# Altium schematic sheet ShEj4.SchDoc
size A
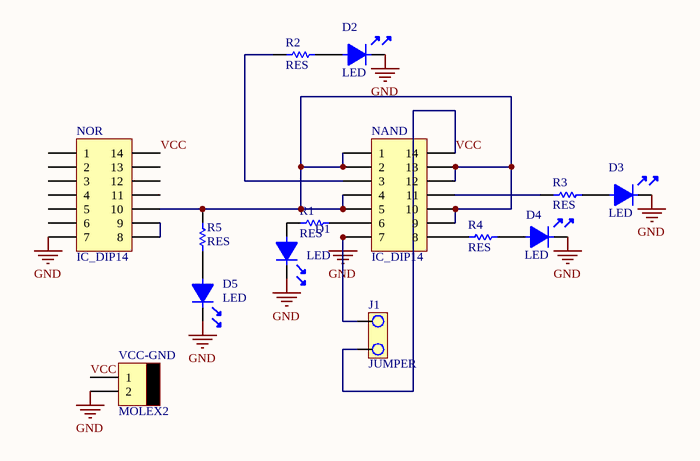
[diagram p0: ShEj4.SchDoc]

## Parts
D1  LED  [LED3]
D2  LED  [LED3]
D3  LED  [LED3]
D4  LED  [LED3]
D5  LED  [LED3]
J1  JUMPER  [JUMPER2]
NAND  IC_DIP14  [DIP14]
NOR  IC_DIP14  [DIP14]
R1  RES  [RES400]
R2  RES  [RES400]
R3  RES  [RES400]
R4  RES  [RES400]
R5  RES  [RES400]
VCC-GND  MOLEX2  [MOLEX2]

## Nets
GND: D1.2 D2.2 D3.2 D4.2 D5.2 J1.2 NAND.7 NOR.7 VCC-GND.2
VCC: J1.1 NAND.14 NOR.14 VCC-GND.1
NetD1_1: D1.1 R1.1
NetD2_1: D2.1 R2.2
NetD3_1: D3.1 R3.2
NetD4_1: D4.1 R4.2
NetD5_1: D5.1 R5.1
NetNAND_1: NAND.1 NAND.2 NAND.4 NAND.5 NAND.9 NAND.10 NAND.12 NAND.13 NOR.10 R5.2
NetNAND_3: NAND.3 R2.1
NetNAND_6: NAND.6 R1.2
NetNAND_8: NAND.8 R4.1
NetNAND_11: NAND.11 R3.1
NetNOR_8: NOR.8 NOR.9

Not connected (* = marked no-connect by the designer): NOR 1 2 3 4 5 6 11 12 13